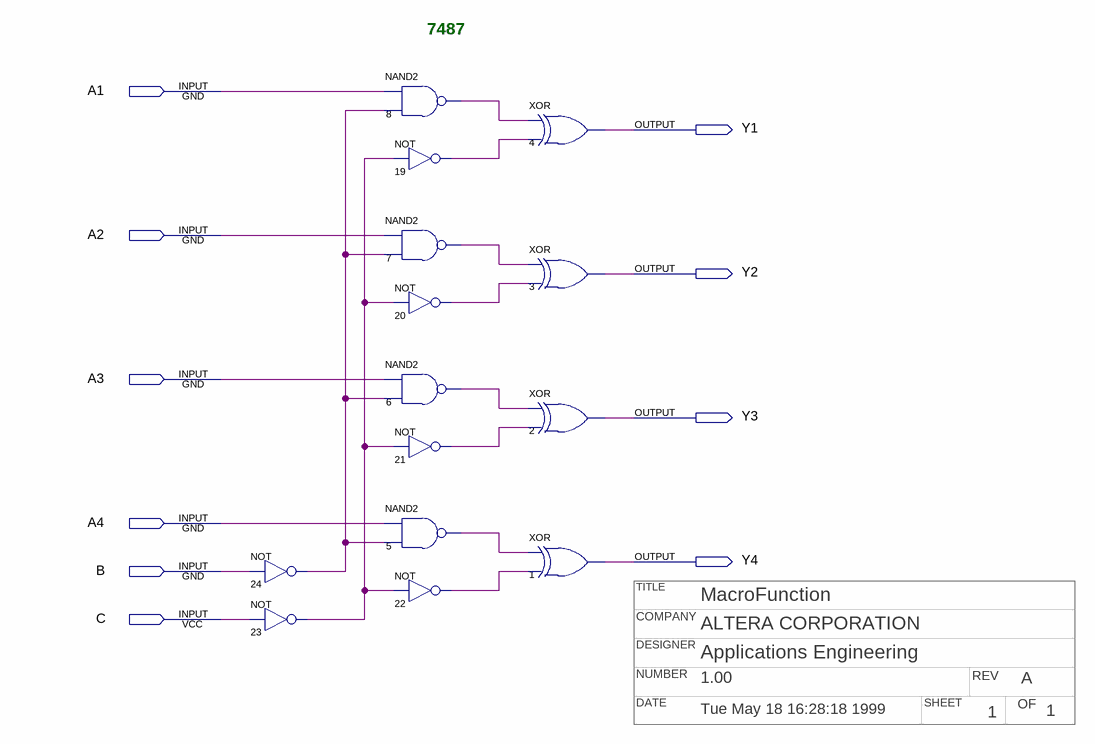
[diagram p0: schematic sheet]
// Quartus schematic 7487.bdf as structural Verilog: 14 symbols, 10 pins
// Title block: TITLE: MacroFunction; COMPANY: ALTERA CORPORATION; DESIGNER: Applications Engineering; NUMBER: 1.00; REV: A; DATE: Tue May 18 16:28:18 1999; SHEET: 1; OF: 1
module \7487  (
  input  A1,
  input  A2,
  input  A3,
  input  A4,
  input  B,
  input  C,
  output Y1,
  output Y2,
  output Y3,
  output Y4
);

  wire n5_out, n6_out, n7_out, n8_out, n19_out, n20_out, n21_out, n22_out, n23_out, n24_out;

  not u_24 (n24_out, B);
  not u_23 (n23_out, C);
  nand u_8 (n8_out, A1, n24_out);
  not u_19 (n19_out, n23_out);
  nand u_7 (n7_out, A2, n24_out);
  not u_20 (n20_out, n23_out);
  nand u_6 (n6_out, A3, n24_out);
  not u_21 (n21_out, n23_out);
  nand u_5 (n5_out, A4, n24_out);
  not u_22 (n22_out, n23_out);
  xor u_4 (Y1, n8_out, n19_out);
  xor u_3 (Y2, n7_out, n20_out);
  xor u_2 (Y3, n6_out, n21_out);
  xor u_1 (Y4, n5_out, n22_out);

  // Notes on the sheet:
  //   7487
endmodule
